# EasyEDA Pro project zkxh_robot_race_FOC_2025.eprj, schematic Schematic2
Board Name: mt6701; Create Date: 2025-09-27; Page Name: P1; Project Name: zkxh_robot_race_FOC_2025; Schematic Name: Schematic2; Update Date: 2025-09-27; Company: 嘉立创EDA; Page Size: A4; Version: V1.0
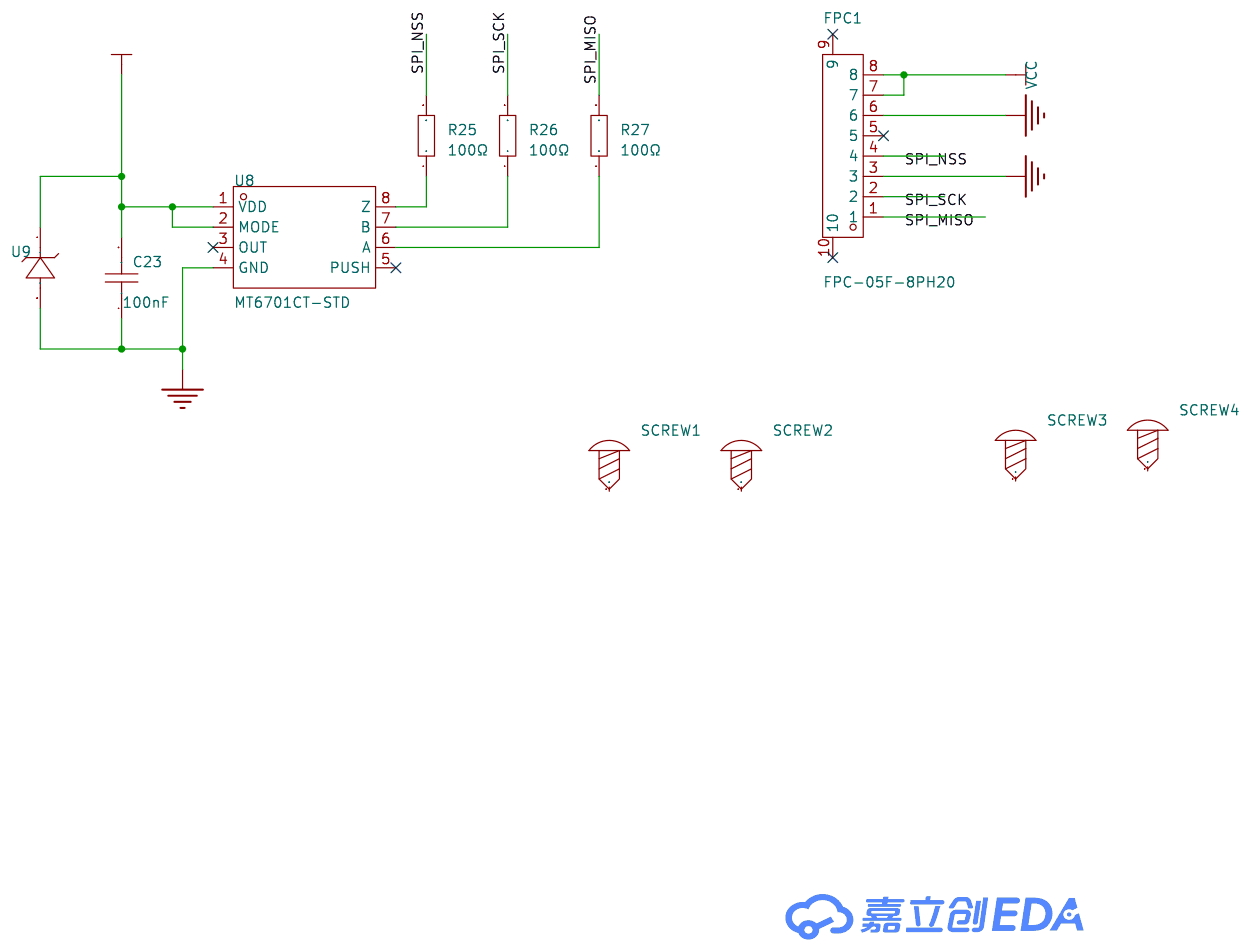
[diagram p1: schematic sheet]

## Parts
C23  100nF  [C0603]
FPC1  FPC-05F-8PH20  [FPC-SMD_8P-P0.50_FPC-05F-8PH20]
R25  100Ω  [R0603]
R26  100Ω  [R0603]
R27  100Ω  [R0603]
SCREW1  -  [M2螺丝]
SCREW2  -  [M2螺丝]
SCREW3  -  [M2螺丝]
SCREW4  -  [M2螺丝]
U8  MT6701CT-STD  [SOP-8_L4.9-W3.9-P1.27-LS6.0-BL]
U9  SMF6.0CA  [SOD-123FL_L2.7-W1.8-LS3.8-RD]

## Library data of the parts
C23 = CC0603KRX7R9BB104: 容值:100nF;精度:±10%;额定电压:50V;材质(温度系数):X7R;; LCSC Part Name: 100nF ±10% 50V; Supplier Part: C14663; Manufacturer: YAGEO(国巨); Supplier Footprint: 0603; JLCPCB Part Class: 基础库; Datasheet: https://atta.szlcsc.com/upload/public/pdf/source/20180910/C282072_33301C7F631E79921B82A8DAC6BCC5B3.pdf; Supplier: LCSC; Tolerance: ±10%; Voltage Rated: 50V; Temperature Coefficient: X7R
FPC1 = FPC-05F-8PH20: 锁定特性:翻盖式;触点类型:下接;触点数量:8P;间距:0.5mm;安装类型:卧贴;工作温度范围:-25℃~+85℃;; LCSC Part Name: 间距:0.5mm P数:8P 翻盖式 下接; Supplier Part: C2856797; Manufacturer: XUNPU(讯普); Supplier Footprint: SMD,P=0.5mm,卧贴; Datasheet: https://atta.szlcsc.com/upload/public/pdf/source/20210728/C2856796_EA80EFD10E16055FE067E7763B90421F.pdf; Supplier: LCSC; Locking Feature: 翻盖式; Contact Type: 下接; Number of Contacts: 8P; Pitch: 0.5mm; Mounting Type: 卧贴; FFC, FCB Thickness: 0.3mm; Height Above Board: 2mm; Operating Temperature Range: -25℃~+85℃
R25-R27 = RC0603FR-07100RL: 电阻类型:厚膜电阻;阻值:100Ω;精度:±1%;功率:100mW;最大工作电压:75V;温度系数:±100ppm/℃;; LCSC Part Name: 厚膜电阻 100Ω ±1% 100mW; Supplier Part: C105588; Manufacturer: YAGEO(国巨); Supplier Footprint: 0603; JLCPCB Part Class: 扩展库; Datasheet: https://atta.szlcsc.com/upload/public/pdf/source/20180316/70C0E2BDAE7FCC62C531A5A58D202EE1.pdf; Supplier: LCSC; Type: 厚膜电阻; Tolerance: ±1%; Power(Watts): 100mW; Overload Voltage (Max): 75V; Temperature Coefficient: ±100ppm/℃; Operating Temperature Range: -55℃~+155℃
SCREW1-SCREW4 = M2螺丝: Supplier Footprint: 插件
U8 = MT6701CT-STD: 磁性编码器 磁性编码开关 磁性角度检测IC 可编程磁性角度位置芯片; LCSC Part Name: 霍尔在线编程角度位置传感器; Supplier Part: C2856764; Manufacturer: MagnTek(麦歌恩); Supplier Footprint: SOP-8; JLCPCB Part Class: 扩展库; Datasheet: https://atta.szlcsc.com/upload/public/pdf/source/20210901/89396AA55DF26524CEF7734A3D9C2FB3.pdf; Supplier: LCSC
U9 = SMF6.0CA_C19077500: 极性:双向;反向截止电压(Vrwm):6V;最大钳位电压:10.3V;峰值脉冲电流(Ipp)@10/1000us:19.4A;峰值脉冲功率(Ppp)@10/1000us:200W;击穿电压:6.67V;; Supplier Part: C19077500; Manufacturer: 宏迦橙; Supplier Footprint: SOD-123FL; JLCPCB Part Class: Extended Part; Datasheet: https://atta.szlcsc.com/upload/public/pdf/source/20231129/4813F17DC56F8B344A8D004597B3633C.pdf; Supplier: LCSC; polarity: 双向; Reverse Stand-Off Voltage (Vrwm): 6V; Maximum Clamping Voltage: 10.3V; Peak Pulse Current (Ipp)@10/1000us: 19.4A; Peak Pulse Power Dissipation (Ppp)@10/1000us: 200W; Breakdown Voltage: 6.67V; Reverse Leakage Current (Ir): 400uA; Number of Lines: 单路; Operating Temperature: -55℃~+155℃; Type: TVS

## Nets
GND: C23.1 FPC1.3 FPC1.6 U8.4(GND) U9.2(A)
VCC: C23.2 FPC1.7 FPC1.8 U8.1(VDD) U8.2(MODE) U9.1(K)
SPI_MISO: FPC1.1 R27.2
SPI_NSS: FPC1.4 R25.2
SPI_SCK: FPC1.2 R26.2
$1N485: R25.1 U8.8(Z)
$1N487: R27.1 U8.6(A)
$1N492: R26.1 U8.7(B)

Not connected (* = marked no-connect by the designer): FPC1 5* 9* 10*; SCREW1 1; SCREW2 1; SCREW3 1; SCREW4 1; U8 3(OUT)* 5(PUSH)*
